# EAGLE schematic Main.sch.bak (EAGLE 7.6.0)
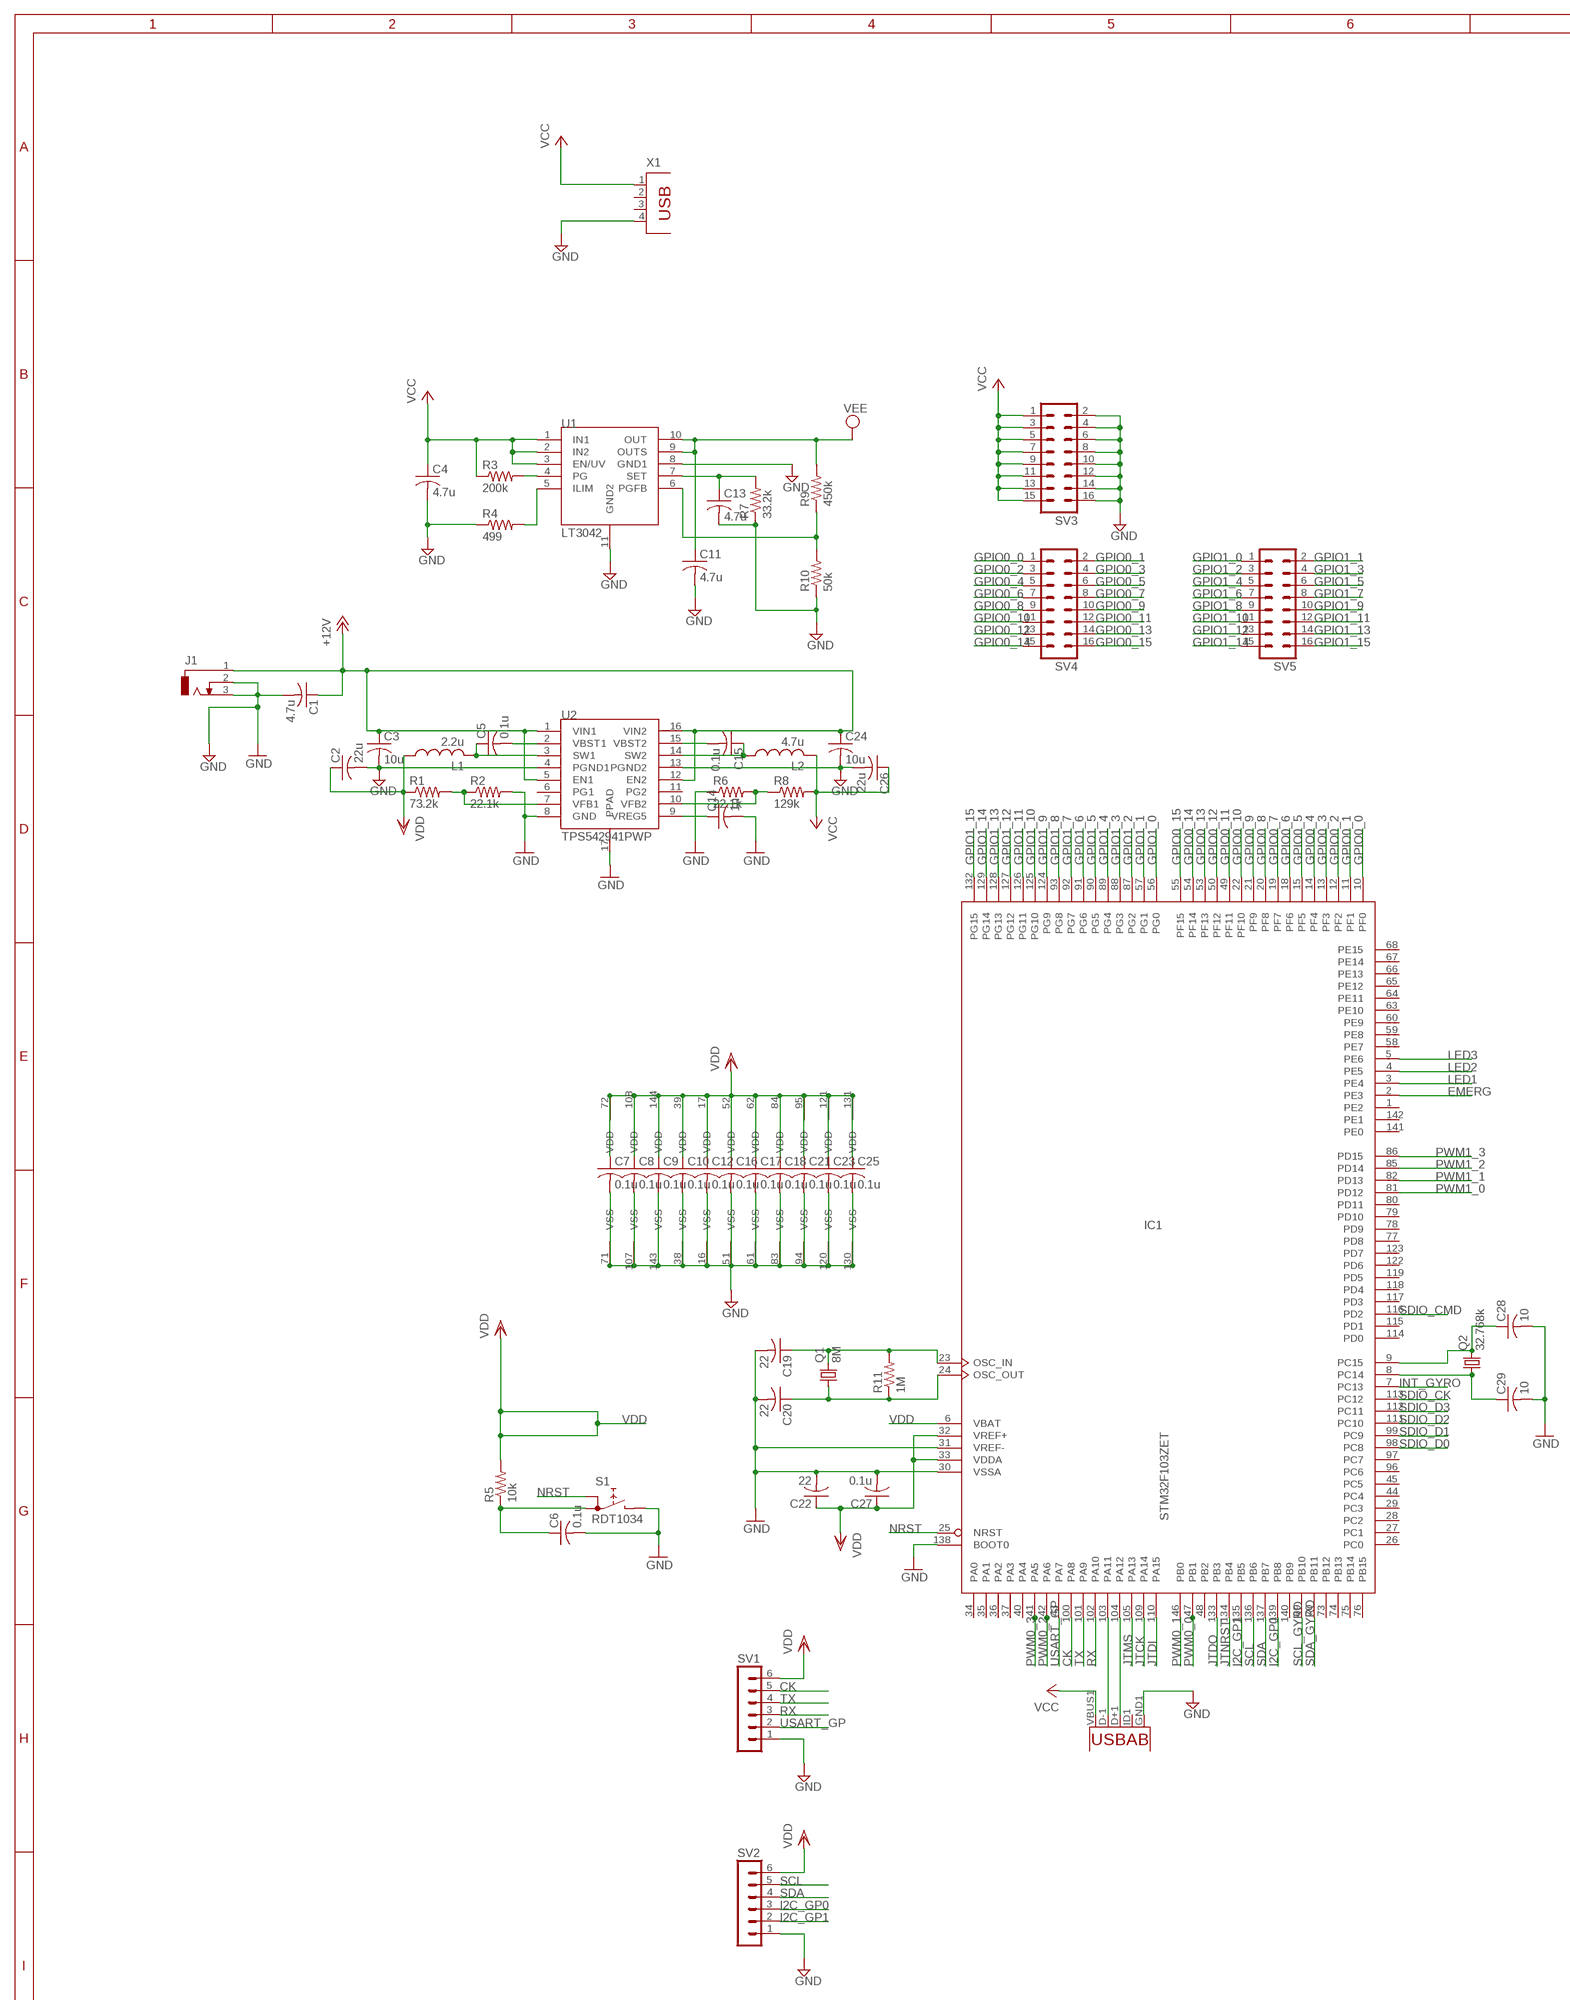
[diagram p0: schematic, sheet 1, part 1 of 2]
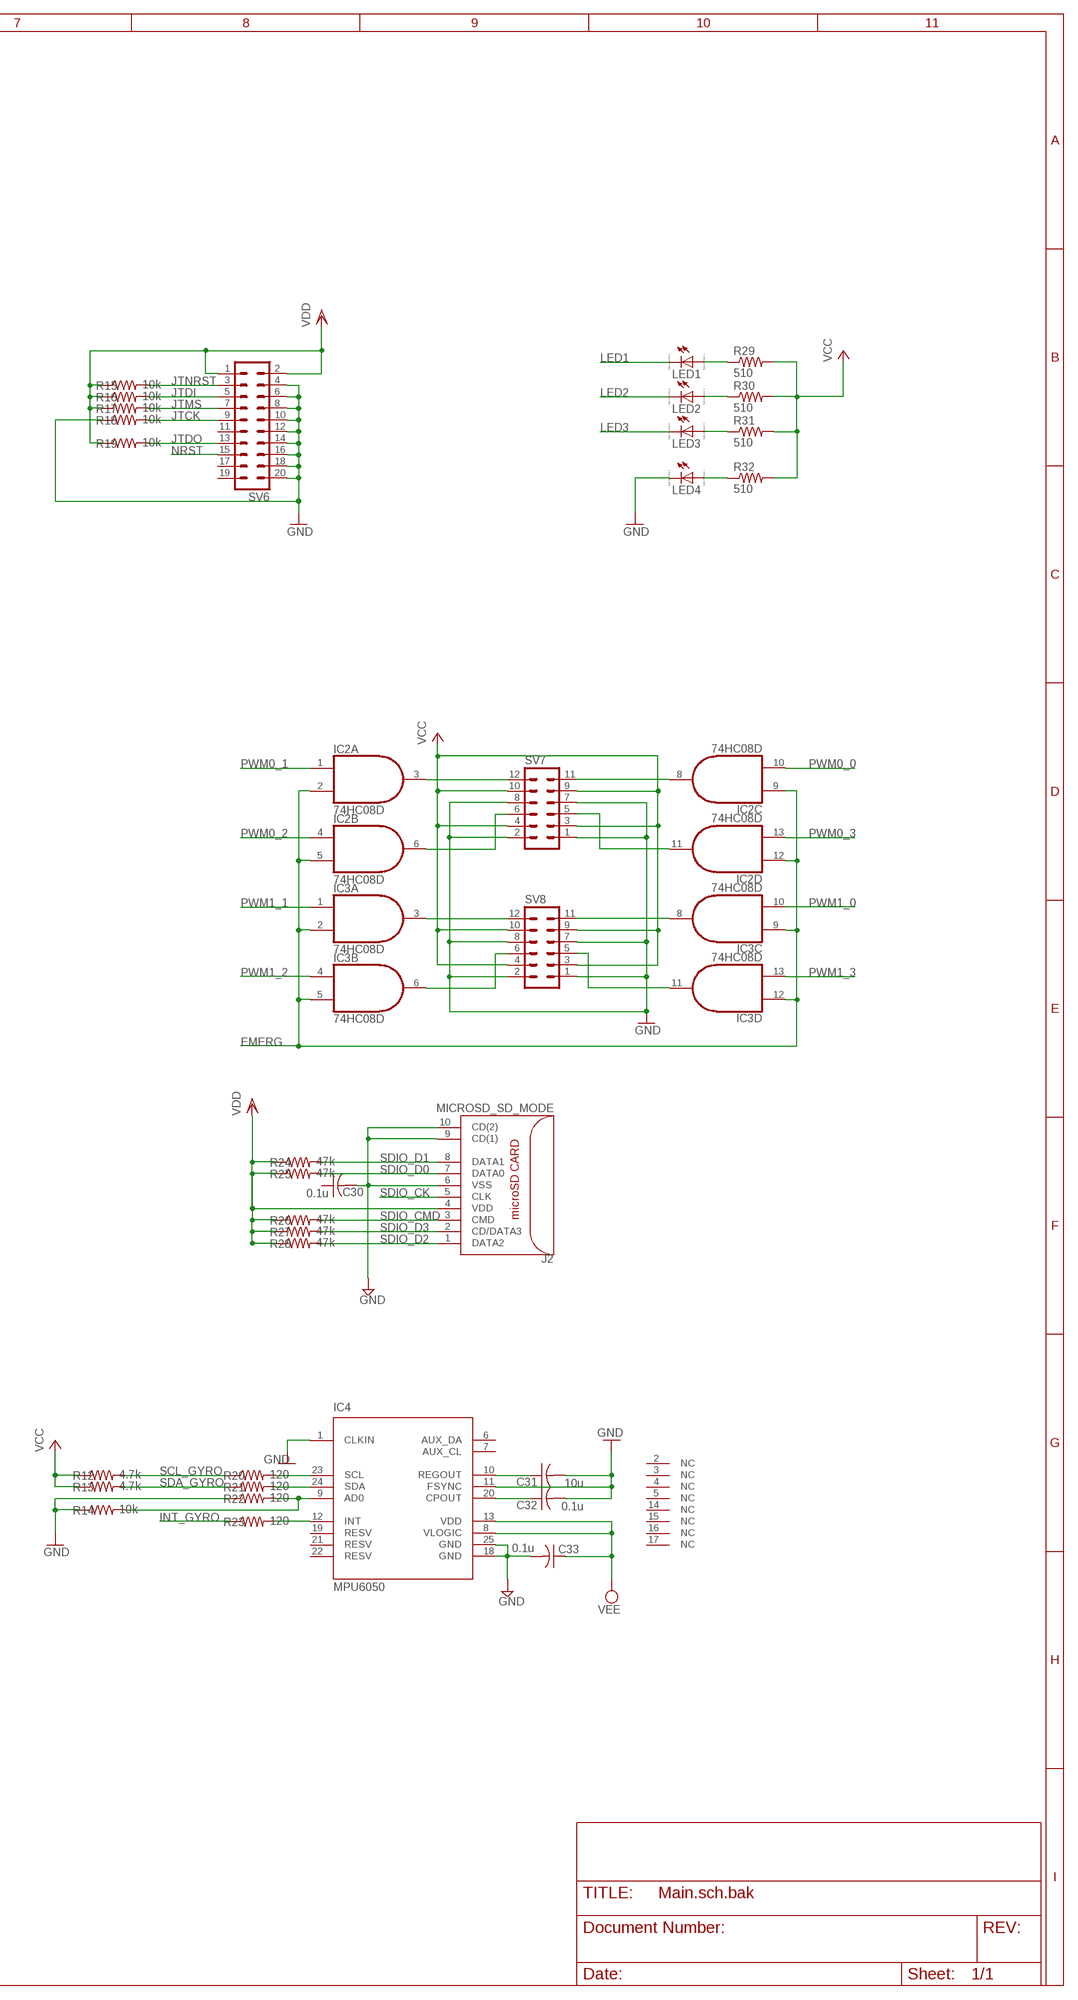
[diagram p1: schematic, sheet 1, part 2 of 2]

## Parts
C1  4.7u  C-USC1206  [C1206]
C2  22u  C-USC0603  [C0603]
C3  10u  C-USC0603  [C0603]
C4  4.7u  C-USC0603  [C0603]
C5  0.1u  C-USC0603  [C0603]
C6  0.1u  C-USC0603  [C0603]
C7  0.1u  C-USC0603  [C0603]
C8  0.1u  C-USC0603  [C0603]
C9  0.1u  C-USC0603  [C0603]
C10  0.1u  C-USC0603  [C0603]
C11  4.7u  C-USC0603  [C0603]
C12  0.1u  C-USC0603  [C0603]
C13  4.7u  C-USC0603  [C0603]
C14  1u  C-USC0603  [C0603]
C15  0.1u  C-USC0603  [C0603]
C16  0.1u  C-USC0603  [C0603]
C17  0.1u  C-USC0603  [C0603]
C18  0.1u  C-USC0603  [C0603]
C19  22  C-USC0603  [C0603]
C20  22  C-USC0603  [C0603]
C21  0.1u  C-USC0603  [C0603]
C22  22  C-USC0603  [C0603]
C23  0.1u  C-USC0603  [C0603]
C24  10u  C-USC0603  [C0603]
C25  0.1u  C-USC0603  [C0603]
C26  22u  C-USC0603  [C0603]
C27  0.1u  C-USC0603  [C0603]
C28  10  C-USC0603  [C0603]
C29  10  C-USC0603  [C0603]
C30  0.1u  C-USC0603  [C0603]
C31  10u  C-USC0603  [C0603]
C32  0.1u  C-USC0603  [C0603]
C33  0.1u  C-USC0603  [C0603]
IC1  STM32F103ZET  [LQFP144]
IC2  74HC08D  [SO14]
IC3  74HC08D  [SO14]
IC4  MPU6050  [QFN50P400X400X95-25T265X275N]
J1  DCJ0303  [DCJ0303]
J2  MICROSD_SD_MODE  [MICRO_SD_CONNECTOR]
L1  2.2u  L-USL1812  [L1812]
L2  4.7u  L-USL1812  [L1812]
LED1  LED_E  [LED_1206]
LED2  LED_E  [LED_1206]
LED3  LED_E  [LED_1206]
LED4  LED_E  [LED_1206]
Q1  8M  CRYSTALHC49UP  [HC49UP]
Q2  32.768k  CRYSTALHC49UP  [HC49UP]
R1  73.2k  R-US_R1206  [R1206]
R2  22.1k  R-US_R1206  [R1206]
R3  200k  R-US_R0603  [R0603]
R4  499  R-US_R0603  [R0603]
R5  10k  R-US_R0603  [R0603]
R6  22.1k  R-US_R1206  [R1206]
R7  33.2k  R-US_R0603  [R0603]
R8  129k  R-US_R1206  [R1206]
R9  450k  R-US_R0603  [R0603]
R10  50k  R-US_R0603  [R0603]
R11  1M  R-US_R0603  [R0603]
R12  4.7k  R-US_R0603  [R0603]
R13  4.7k  R-US_R0603  [R0603]
R14  10k  R-US_R0603  [R0603]
R15  10k  R-US_R0603  [R0603]
R16  10k  R-US_R0603  [R0603]
R17  10k  R-US_R0603  [R0603]
R18  10k  R-US_R0603  [R0603]
R19  10k  R-US_R0603  [R0603]
R20  120  R-US_R0603  [R0603]
R21  120  R-US_R0603  [R0603]
R22  120  R-US_R0603  [R0603]
R23  120  R-US_R0603  [R0603]
R24  47k  R-US_R0603  [R0603]
R25  47k  R-US_R0603  [R0603]
R26  47k  R-US_R0603  [R0603]
R27  47k  R-US_R0603  [R0603]
R28  47k  R-US_R0603  [R0603]
R29  510  R-US_R0603  [R0603]
R30  510  R-US_R0603  [R0603]
R31  510  R-US_R0603  [R0603]
R32  510  R-US_R0603  [R0603]
S1  RDT1034  [RDT1034]
SV1  MA06-1  [MA06-1]
SV2  MA06-1  [MA06-1]
SV3  MA08-2  [MA08-2]
SV4  MA08-2  [MA08-2]
SV5  MA08-2  [MA08-2]
SV6  MA10-2  [MA10-2]
SV7  MA06-2  [MA06-2]
SV8  MA06-2  [MA06-2]
U1  LT3042  [LT3042]
U2  TPS542941PWP  [HTSSOP16]
U3  USB""  [USB-MICRO-SMD]
X1  PN87520  [PN87520]

## Nets
+12V: C1.1 C3.1 C24.1 J1.1 U2.1(VIN1) U2.5(EN1) U2.12(EN2) U2.16(VIN2)
CK: IC1.100(PA8) SV1.5
EMERG: IC1.2(PE3) IC2.2(A:I1) IC2.5(B:I1) IC2.9(C:I0) IC2.12(D:I0) IC3.2(A:I1) IC3.5(B:I1) IC3.9(C:I0) IC3.12(D:I0)
GND: C1.2 C2.2 C3.2 C4.2 C6.2 C7.2 C8.2 C9.2 C10.2 C11.2 C12.2 C13.2 C14.2 C16.2 C17.2 C18.2 C19.2 C20.2 C21.2 C22.2 C23.2 C24.2 C25.2 C26.2 C27.2 C28.2 C29.2 C30.2 C31.2 C32.2 C33.2 IC1.16(VSS) IC1.30(VSSA) IC1.31(VREF-) IC1.38(VSS) IC1.51(VSS) IC1.61(VSS) IC1.71(VSS) IC1.83(VSS) IC1.94(VSS) IC1.107(VSS) IC1.120(VSS) IC1.130(VSS) IC1.138(BOOT0) IC1.143(VSS) IC4.1(CLKIN) IC4.11(FSYNC) IC4.18(GND) IC4.25(GND) J1.2 J1.3 J2.6(VSS) J2.9(CD(1)) J2.10(CD(2)) LED4.C R2.2 R4.1 R6.1 R7.1 R10.1 R14.1 R18.1 R22.1 S1.B SV1.1 SV2.1 SV3.2 SV3.4 SV3.6 SV3.8 SV3.10 SV3.12 SV3.14 SV3.16 SV6.4 SV6.6 SV6.8 SV6.10 SV6.12 SV6.14 SV6.16 SV6.18 SV6.20 SV7.1 SV7.2 SV7.7 SV7.8 SV8.1 SV8.2 SV8.7 SV8.8 U1.8(GND1) U1.11(GND2) U2.4(PGND1) U2.8(GND) U2.13(PGND2) U2.17(PPAD) U3.GND1(GND) X1.4
GPIO0_0: IC1.10(PF0) SV4.1
GPIO0_1: IC1.11(PF1) SV4.2
GPIO0_2: IC1.12(PF2) SV4.3
GPIO0_3: IC1.13(PF3) SV4.4
GPIO0_4: IC1.14(PF4) SV4.5
GPIO0_5: IC1.15(PF5) SV4.6
GPIO0_6: IC1.18(PF6) SV4.7
GPIO0_7: IC1.19(PF7) SV4.8
GPIO0_8: IC1.20(PF8) SV4.9
GPIO0_9: IC1.21(PF9) SV4.10
GPIO0_10: IC1.22(PF10) SV4.11
GPIO0_11: IC1.49(PF11) SV4.12
GPIO0_12: IC1.50(PF12) SV4.13
GPIO0_13: IC1.53(PF13) SV4.14
GPIO0_14: IC1.54(PF14) SV4.15
GPIO0_15: IC1.55(PF15) SV4.16
GPIO1_0: IC1.56(PG0) SV5.1
GPIO1_1: IC1.57(PG1) SV5.2
GPIO1_2: IC1.87(PG2) SV5.3
GPIO1_3: IC1.88(PG3) SV5.4
GPIO1_4: IC1.89(PG4) SV5.5
GPIO1_5: IC1.90(PG5) SV5.6
GPIO1_6: IC1.91(PG6) SV5.7
GPIO1_7: IC1.92(PG7) SV5.8
GPIO1_8: IC1.93(PG8) SV5.9
GPIO1_9: IC1.124(PG9) SV5.10
GPIO1_10: IC1.125(PG10) SV5.11
GPIO1_11: IC1.126(PG11) SV5.12
GPIO1_12: IC1.127(PG12) SV5.13
GPIO1_13: IC1.128(PG13) SV5.14
GPIO1_14: IC1.129(PG14) SV5.15
GPIO1_15: IC1.132(PG15) SV5.16
I2C_GP0: IC1.139(PB8) SV2.3
I2C_GP1: IC1.135(PB5) SV2.2
INT_GYRO: IC1.7(PC13) R23.1
JTCK: IC1.109(PA14) R18.2 SV6.9
JTDI: IC1.110(PA15) R16.2 SV6.5
JTDO: IC1.133(PB3) R19.2 SV6.13
JTMS: IC1.105(PA13) R17.2 SV6.7
JTNRST: IC1.134(PB4) R15.2 SV6.3
LED1: IC1.3(PE4) LED1.C
LED2: IC1.4(PE5) LED2.C
LED3: IC1.5(PE6) LED3.C
N$1: C19.1 IC1.23(OSC_IN) Q1.2 R11.2
N$2: C20.1 IC1.24(OSC_OUT) Q1.1 R11.1
N$3: IC1.103(PA11) U3.D-1(D-)
N$4: C29.1 IC1.8(PC14) Q2.1
N$5: C28.1 IC1.9(PC15) Q2.2
N$6: IC1.104(PA12) U3.D+1(D+)
N$7: C6.1 R5.1 S1.A1
N$8: LED4.A R32.1
N$9: LED1.A R29.1
N$10: IC4.23(SCL) R20.2
N$11: IC2.3(A:O) SV7.12
N$12: IC4.24(SDA) R21.2
N$13: LED2.A R30.1
N$14: C5.2 U2.2(VBST1)
N$15: IC4.12(INT) R23.2
N$16: C31.1 IC4.10(REGOUT)
N$17: C32.1 IC4.20(CPOUT)
N$18: IC4.9(AD0) R14.2 R22.2
N$19: LED3.A R31.1
N$20: C15.2 U2.15(VBST2)
N$21: C5.1 L1.2 U2.3(SW1)
N$22: R3.2 U1.4(PG)
N$23: C15.1 L2.1 U2.14(SW2)
N$24: R4.2 U1.5(ILIM)
N$25: R9.1 R10.2 U1.6(PGFB)
N$26: R1.2 R2.1 U2.7(VFB1)
N$27: C13.1 R7.2 U1.7(SET)
N$28: R6.2 R8.1 U2.10(VFB2)
N$29: IC2.6(B:O) SV7.6
N$30: C14.1 U2.9(VREG5)
N$31: IC2.11(D:O) SV7.5
N$32: IC2.8(C:O) SV7.11
N$33: IC3.3(A:O) SV8.12
N$34: IC3.6(B:O) SV8.6
N$35: IC3.11(D:O) SV8.5
N$36: IC3.8(C:O) SV8.11
NRST: IC1.25(NRST) S1.A SV6.15
PWM0_0: IC1.47(PB1)
PWM0_1: IC1.46(PB0)
PWM0_2: IC1.42(PA6)
PWM0_3: IC1.41(PA5)
PWM1_0: IC1.81(PD12)
PWM1_1: IC1.82(PD13)
PWM1_2: IC1.85(PD14)
PWM1_3: IC1.86(PD15)
RX: IC1.102(PA10) SV1.3
SCL: IC1.136(PB6) SV2.5
SCL_GYRO: IC1.69(PB10) R12.2 R20.1
SDA: IC1.137(PB7) SV2.4
SDA_GYRO: IC1.70(PB11) R13.2 R21.1
SDIO_CK: IC1.113(PC12) J2.5(CLK)
SDIO_CMD: IC1.116(PD2) J2.3(CMD) R26.2
SDIO_D0: IC1.98(PC8) J2.7(DATA0) R25.2
SDIO_D1: IC1.99(PC9) J2.8(DATA1) R24.2
SDIO_D2: IC1.111(PC10) J2.1(DATA2) R28.2
SDIO_D3: IC1.112(PC11) J2.2(CD/DATA3) R27.2
TX: IC1.101(PA9) SV1.4
USART_GP: IC1.43(PA7) SV1.2
VCC: C4.1 C26.1 L2.2 R3.1 R8.2 R12.1 R13.1 R29.2 R30.2 R31.2 R32.2 SV3.1 SV3.3 SV3.5 SV3.7 SV3.9 SV3.11 SV3.13 SV3.15 SV7.3 SV7.4 SV7.9 SV7.10 SV8.3 SV8.4 SV8.9 SV8.10 U1.1(IN1) U1.2(IN2) U1.3(EN/UV) U3.VBUS1(VBUS) X1.1
VDD: C2.1 C7.1 C8.1 C9.1 C10.1 C12.1 C16.1 C17.1 C18.1 C21.1 C22.1 C23.1 C25.1 C27.1 IC1.6(VBAT) IC1.17(VDD) IC1.32(VREF+) IC1.33(VDDA) IC1.39(VDD) IC1.52(VDD) IC1.62(VDD) IC1.72(VDD) IC1.84(VDD) IC1.95(VDD) IC1.108(VDD) IC1.121(VDD) IC1.131(VDD) IC1.144(VDD) J2.4(VDD) L1.1 R1.1 R5.2 R15.1 R16.1 R17.1 R19.1 R24.1 R25.1 R26.1 R27.1 R28.1 SV1.6 SV2.6 SV6.1 SV6.2
VEE: C11.1 C33.1 IC4.8(VLOGIC) IC4.13(VDD) R9.2 U1.9(OUTS) U1.10(OUT)
Unconnected: C30.1 IC1.1(PE2) IC1.26(PC0) IC1.27(PC1) IC1.28(PC2) IC1.29(PC3) IC1.34(PA0) IC1.35(PA1) IC1.36(PA2) IC1.37(PA3) IC1.40(PA4) IC1.44(PC4) IC1.45(PC5) IC1.48(PB2) IC1.58(PE7) IC1.59(PE8) IC1.60(PE9) IC1.63(PE10) IC1.64(PE11) IC1.65(PE12) IC1.66(PE13) IC1.67(PE14) IC1.68(PE15) IC1.73(PB12) IC1.74(PB13) IC1.75(PB14) IC1.76(PB15) IC1.77(PD8) IC1.78(PD9) IC1.79(PD10) IC1.80(PD11) IC1.96(PC6) IC1.97(PC7) IC1.114(PD0) IC1.115(PD1) IC1.117(PD3) IC1.118(PD4) IC1.119(PD5) IC1.122(PD6) IC1.123(PD7) IC1.140(PB9) IC1.141(PE0) IC1.142(PE1) IC2.1(A:I0) IC2.4(B:I0) IC2.10(C:I1) IC2.13(D:I1) IC3.1(A:I0) IC3.4(B:I0) IC3.10(C:I1) IC3.13(D:I1) IC4.2(NC) IC4.3(NC) IC4.4(NC) IC4.5(NC) IC4.6(AUX_DA) IC4.7(AUX_CL) IC4.14(NC) IC4.15(NC) IC4.16(NC) IC4.17(NC) IC4.19(RESV) IC4.21(RESV) IC4.22(RESV) SV6.11 SV6.17 SV6.19 U2.6(PG1) U2.11(PG2) U3.ID1(USBID) X1.2 X1.3

## Power pins joined to a net without a drawn wire
GND: IC2.7(P:GND) IC3.7(P:GND)
VCC: IC2.14(P:VCC) IC3.14(P:VCC)

## Library data of the parts
C1-C33 = rcl:C-US: CAPACITOR, American symbol
IC1 = micro-stm_v3:STM32F103Z*T: ARM 32-bit Cortex™-M3 CPU 72 MHz maximum frequency 256 to 1024 Kbytes of Flash memory 48 to 96 kbytes of SRAM 112 GPIOs 2.0 to 3.6 V application supply
IC2 IC3 = 74xx-us:74*08: Quad 2-input AND gate
IC4 = invensense:MPU6050: The triple-axis MEMS gyroscope
J1 = con-jack:DCJ0303: DC POWER JACK Source: DCJ0303.pdf; OC_FARNELL: unknown; OC_NEWARK: unknown
J2 = con-molex-microsd:MICROSD_SD_MODE: MOLEX - 49225-0821 - CONNECTEUR MICRO SD PUSH/PUSH REV Fabricant: MOLEX Code commande Farnell: 1366700 <http://fr.farnell.com/molex/49225-0821/connecteur-micro-sd-push-push-rev/dp/1366700?Ntt=1366700> Référence fabricant: 49225-0821
L1 L2 = rcl:L-US: INDUCTOR, American symbol
LED1-LED4 = eagle-ltspice:LED_E: LED Source: http://www.osram.convergy.de Source: www.luxeon.com Source: www.kingbright.com; SPICEMODEL: NONE; SPICEPREFIX: D; SPICETYPE: diode
Q1 Q2 = crystal:CRYSTAL: CRYSTAL; OC_FARNELL: unknown; OC_NEWARK: unknown
R1-R14 R20-R32 = rcl:R-US_: RESISTOR, American symbol
R15-R19 = resistor:R-US_: RESISTOR, American symbol
S1 = switch:RDT1034: PUSH SWITCH www.radiohm.com
SV1 SV2 = con-lstb:MA06-1: PIN HEADER; OC_FARNELL: unknown; OC_NEWARK: unknown
SV3-SV5 = con-lstb:MA08-2: PIN HEADER; OC_FARNELL: unknown; OC_NEWARK: unknown
SV6 = con-lstb:MA10-2: PIN HEADER; OC_FARNELL: unknown; OC_NEWARK: unknown
SV7 SV8 = con-lstb:MA06-2: PIN HEADER; OC_FARNELL: unknown; OC_NEWARK: unknown
U1 = LT3042:LT3042
U2 = TPS542941:TPS542941PWP
U3 = MicroUSB:USB: This is a USB AB connector that is compatible with USB OTG. i.e. this connector can serve as a host or device
X1 = con-berg:PN87520: BERG USB connector; OC_FARNELL: unknown; OC_NEWARK: unknown